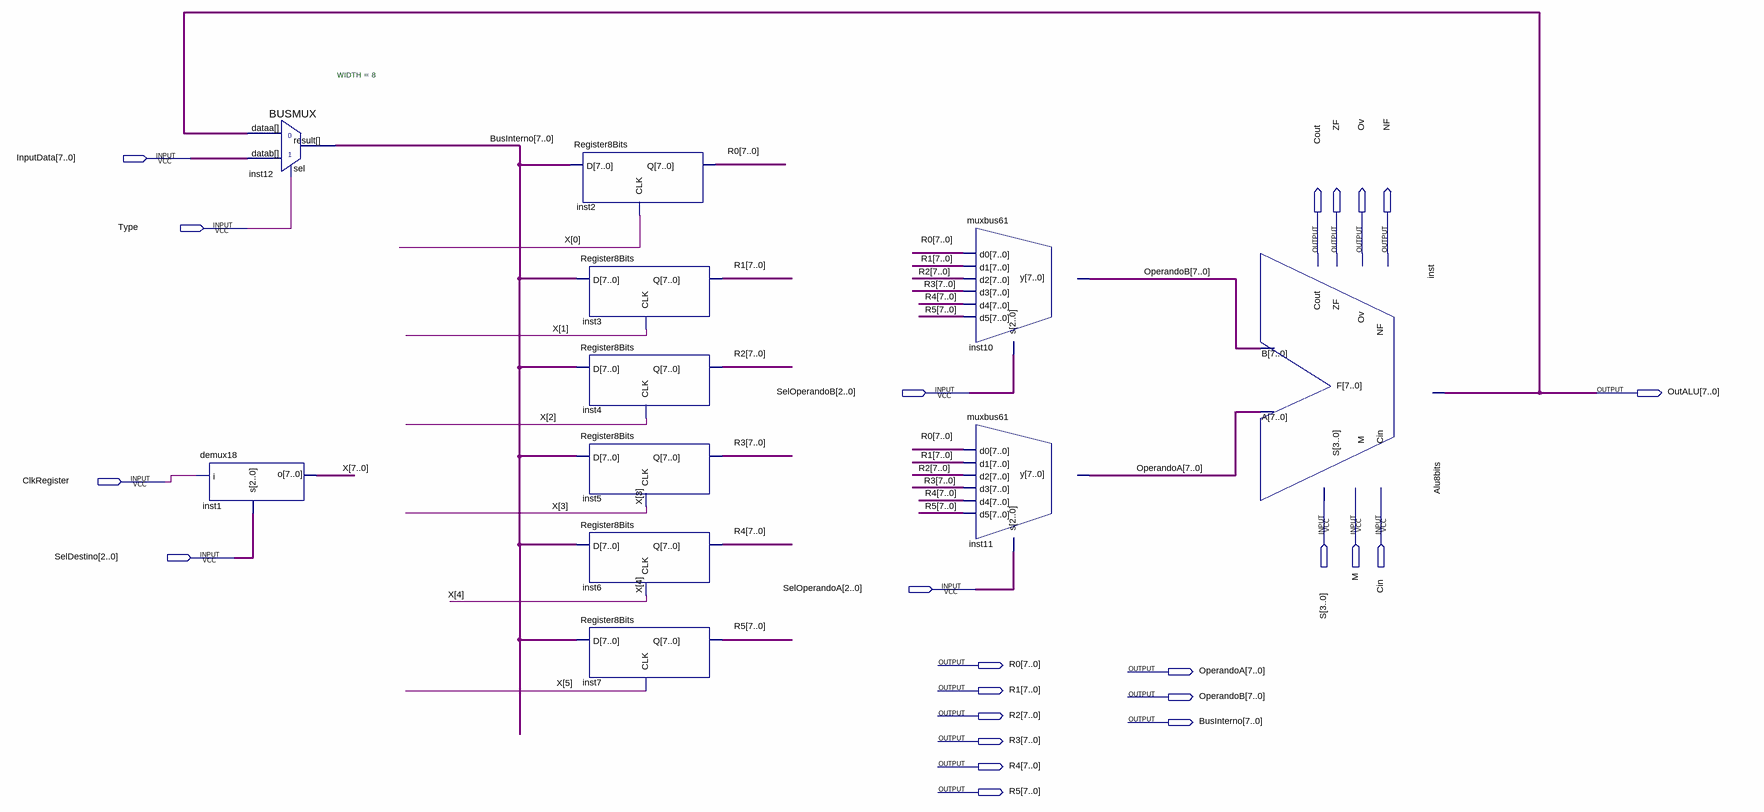
[diagram p0: schematic sheet]
// Quartus schematic CPU8bits.bdf as structural Verilog: 11 symbols, 23 pins
module CPU8bits (
  input  [7:0] InputData,
  input  Type,
  input  [2:0] SelOperandoB,
  input  ClkRegister,
  input  [3:0] S,
  input  M,
  input  Cin,
  input  [2:0] SelDestino,
  input  [2:0] SelOperandoA,
  output Cout,
  output ZF,
  output Ov,
  output NF,
  output [7:0] OutALU,
  output [7:0] R0,
  output [7:0] OperandoA,
  output [7:0] R1,
  output [7:0] OperandoB,
  output [7:0] R2,
  output [7:0] BusInterno,
  output [7:0] R3,
  output [7:0] R4,
  output [7:0] R5
);

  wire [7:0] X;

  demux18 inst1 (.i(ClkRegister), .s(SelDestino), .o(X));
  BUSMUX #(.WIDTH(8)) inst12 (.datab(InputData), .sel(Type), .dataa(OutALU), .result(BusInterno));
  Register8Bits inst2 (.D(BusInterno), .CLK(X[0]), .Q(R0));
  Register8Bits inst3 (.D(BusInterno), .CLK(X[1]), .Q(R1));
  Register8Bits inst4 (.D(BusInterno), .CLK(X[2]), .Q(R2));
  Register8Bits inst5 (.D(BusInterno), .CLK(X[3]), .Q(R3));
  Register8Bits inst6 (.D(BusInterno), .CLK(X[4]), .Q(R4));
  Register8Bits inst7 (.D(BusInterno), .CLK(X[5]), .Q(R5));
  muxbus61 inst10 (.s(SelOperandoB), .d0(R0), .d1(R1), .d2(R2), .d3(R3), .d4(R4), .d5(R5), .y(OperandoB));
  muxbus61 inst11 (.s(SelOperandoA), .d0(R0), .d1(R1), .d2(R2), .d3(R3), .d4(R4), .d5(R5), .y(OperandoA));
  Alu8bits inst (
    .A(OperandoA), .B(OperandoB), .S(S), .M(M), .Cin(Cin), .F(OutALU), .Cout(Cout), .ZF(ZF), .Ov(Ov), .NF(NF));
endmodule
